# Altium schematic sheet I2C DP Sensor 1.SchDoc: I2C Delta Pressure Sensor 1
size 292 x 193 mm; SheetNumber: 8; SheetTotal: 21
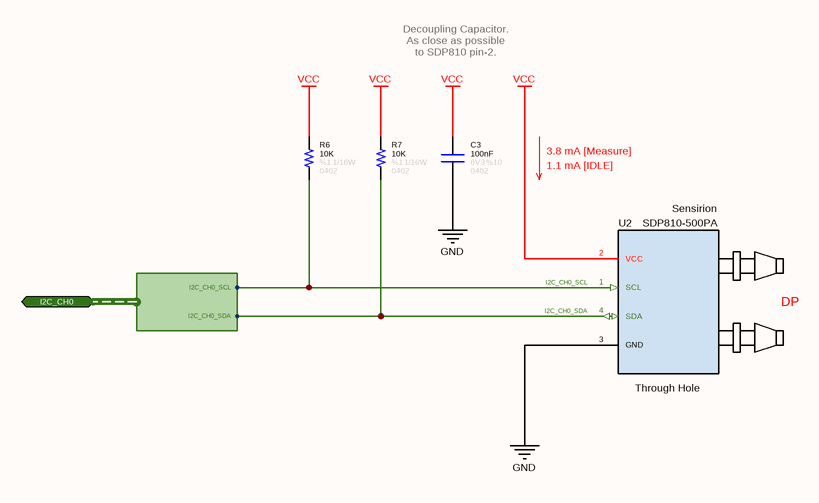
[diagram p0: I2C DP Sensor 1.SchDoc]

## Parts
C3  value 100nF  Tolerance: %10  Voltage: 6V3  Case: 0402  [CAPACITOR_0402]  (hidden comment: Capacitor - 100nF [0402] (Ceramic))
R6  value 10K  Tolerance: %1  Case: 0402  Power: 1/16W  [RESISTOR_0402]  (hidden comment: 10K - 0402 - %1 - 1/16W)
R7  value 10K  Tolerance: %1  Case: 0402  Power: 1/16W  [RESISTOR_0402]  (hidden comment: 10K - 0402 - %1 - 1/16W)
U2  Manufacturer Name: Sensirion  Case: Through Hole  [SDP810-500PA]  (hidden comment: SDP810-500PA)

## Ports
I2C_CH0 (bidir, harness I2C_CH0)

## Harnesses
I2C_CH0: I2C_CH0_SCL, I2C_CH0_SDA

## Nets
GND: C3.1 U2.3(GND)
VCC: C3.2 R6.2 R7.2 U2.2(VCC)
I2C_CH0_SCL: R6.1 U2.1(SCL) ; port I2C_CH0.I2C_CH0_SCL
I2C_CH0_SDA: R7.1 U2.4(SDA) ; port I2C_CH0.I2C_CH0_SDA

## Notes on the sheet
- Decoupling Capacitor. As close as possible to SDP810 pin-2.
- 3.8 mA [Measure]
- 1.1 mA [IDLE]
- © 2021 All rights reserved.
  This document may not, in whole or in part, be copied, photocopied, reproduced, translated or converted to any electronic or machine readable from without prior written permission of Mehmet Günce Akkoyun.
  Engineer contact : akkoyun@me.com
- Property of
- Engineer :
- Date :
- Size :
- A4
- Time :
- Project :
- Page :
- /
- Customer :
- Product ID :
- Module ID :
- Version :
- File :
- Revision :
- (in symbol IC - SDP810-500PA) DP

## Library data of the parts
C3 = Capacitor - 100nF [0402-6V3]: Capacitor - 100nF [0402-6V3] (Ceramic); Manufacturer Name: AVX; Manufacturer Part Number: 04026D104KAT4A; ComponentLink1Description: Mouser; ComponentLink1URL: https://www.mouser.com.tr/ProductDetail/AVX/04026D104KAT4A?qs=sGAEpiMZZMs0AnBnWHyRQPg4iYkCw7IMED%2F4kpqgf7w%3D; ComponentLink2Description: DataSheet; ComponentLink2URL: https://www.mouser.com.tr/datasheet/2/40/cx5r-776519.pdf
R6 R7 = Resistor - 10K [0402]: Thick Film Resistors - SMD 1/16 W 10 KOhm 1%; Manufacturer Name: Vishay; Manufacturer Part Number: CRCW040210K0FKED; ComponentLink1Description: DataSheet; ComponentLink1URL: https://www.mouser.com.tr/datasheet/2/427/dcrcwe3-1762152.pdf; ComponentLink2Description: Mouser; ComponentLink2URL: https://www.mouser.com.tr/ProductDetail/Vishay-Dale/CRCW040210K0FKED?qs=sGAEpiMZZMu61qfTUdNhG2DpbjADlD3GcalbOv9utCY%3D
U2 = IC - SDP810-500PA: Board Mount Pressure Sensors Tube Connection, I2C , 500Pa; Operating Pressure: - 500 Pa to 500 Pa; Accuracy: 3 %; RoHS: Yes; Product Type: Differential Pressure Sensors; Manufacturer Part Number: SDP810-500PA